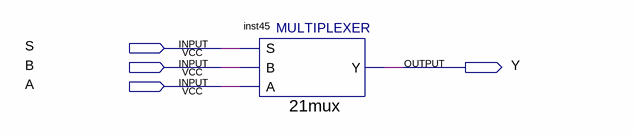
[diagram p0: schematic sheet]
// Quartus schematic Test.bdf as structural Verilog: 1 symbols, 4 pins
module Test (
  input  S,
  input  B,
  input  A,
  output Y
);

  \21mux  inst45 (.S(S), .B(B), .A(A), .Y(Y));
endmodule
